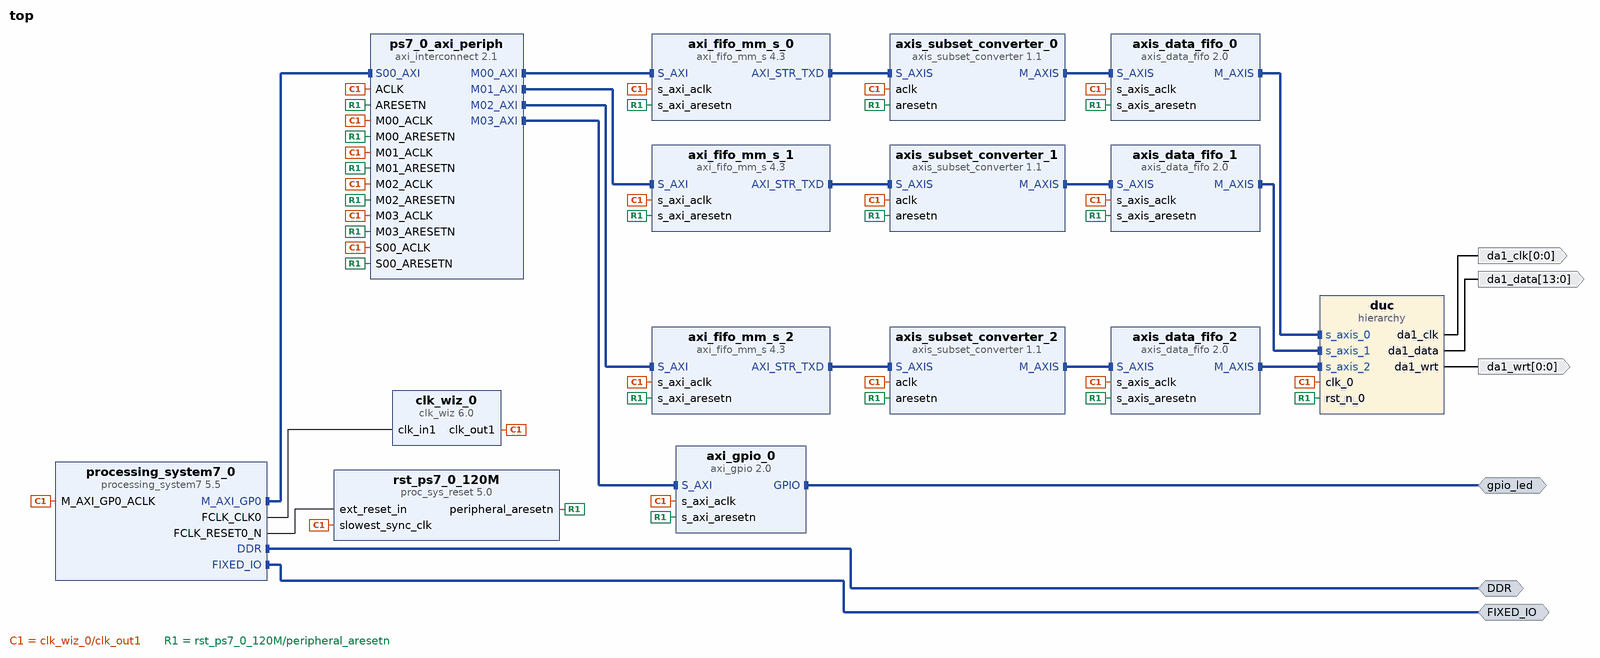
[diagram p0: block diagram of the top level]
# Vivado block design top, xc7z020clg400-2, Vivado 2023.2
create_bd_design top

create_bd_intf_port -mode Master -vlnv xilinx.com:interface:ddrx_rtl:1.0 DDR
create_bd_intf_port -mode Master -vlnv xilinx.com:display_processing_system7:fixedio_rtl:1.0 FIXED_IO
create_bd_intf_port -mode Master -vlnv xilinx.com:interface:gpio_rtl:1.0 gpio_led
create_bd_port -dir O -from 0 -to 0 da1_clk
create_bd_port -dir O -from 0 -to 0 da1_wrt
create_bd_port -dir O -from 13 -to 0 da1_data

create_bd_cell -type ip -vlnv xilinx.com:ip:processing_system7:5.5 processing_system7_0
set_property -dict [list \
  CONFIG.PCW_ENET0_ENET0_IO {MIO 16 .. 27} \
  CONFIG.PCW_ENET0_GRP_MDIO_ENABLE 1 \
  CONFIG.PCW_ENET0_GRP_MDIO_IO {MIO 52 .. 53} \
  CONFIG.PCW_ENET0_PERIPHERAL_ENABLE 1 \
  CONFIG.PCW_ENET0_RESET_ENABLE 0 \
  CONFIG.PCW_ENET_RESET_ENABLE 1 \
  CONFIG.PCW_ENET_RESET_SELECT {Share reset pin} \
  CONFIG.PCW_FPGA0_PERIPHERAL_FREQMHZ 120 \
  CONFIG.PCW_GPIO_EMIO_GPIO_ENABLE 1 \
  CONFIG.PCW_GPIO_EMIO_GPIO_IO 64 \
  CONFIG.PCW_GPIO_MIO_GPIO_ENABLE 1 \
  CONFIG.PCW_GPIO_MIO_GPIO_IO MIO \
  CONFIG.PCW_I2C_RESET_ENABLE 1 \
  CONFIG.PCW_PRESET_BANK1_VOLTAGE {LVCMOS 1.8V} \
  CONFIG.PCW_QSPI_GRP_SINGLE_SS_ENABLE 1 \
  CONFIG.PCW_QSPI_GRP_SINGLE_SS_IO {MIO 1 .. 6} \
  CONFIG.PCW_QSPI_PERIPHERAL_ENABLE 1 \
  CONFIG.PCW_QSPI_QSPI_IO {MIO 1 .. 6} \
  CONFIG.PCW_SD0_GRP_CD_ENABLE 1 \
  CONFIG.PCW_SD0_GRP_CD_IO {MIO 47} \
  CONFIG.PCW_SD0_GRP_WP_ENABLE 0 \
  CONFIG.PCW_SD0_PERIPHERAL_ENABLE 1 \
  CONFIG.PCW_SD0_SD0_IO {MIO 40 .. 45} \
  CONFIG.PCW_SDIO_PERIPHERAL_FREQMHZ 100 \
  CONFIG.PCW_SINGLE_QSPI_DATA_MODE x4 \
  CONFIG.PCW_UART1_PERIPHERAL_ENABLE 1 \
  CONFIG.PCW_UART1_UART1_IO {MIO 48 .. 49} \
  CONFIG.PCW_UART_PERIPHERAL_FREQMHZ 100 \
  CONFIG.PCW_UIPARAM_DDR_PARTNO {MT41J256M16 RE-125} \
  CONFIG.PCW_USB0_PERIPHERAL_ENABLE 1 \
  CONFIG.PCW_USB0_RESET_ENABLE 1 \
  CONFIG.PCW_USB0_RESET_IO {MIO 46} \
  CONFIG.PCW_USB0_USB0_IO {MIO 28 .. 39} \
  CONFIG.PCW_USB_RESET_ENABLE 1 \
  CONFIG.PCW_USB_RESET_SELECT {Share reset pin} \
  CONFIG.PCW_USE_FABRIC_INTERRUPT 1 \
] [get_bd_cells processing_system7_0]
# 208 more settings of processing_system7_0 are not shown: defaults, MIO pin electricals, DDR timing, and values the tool derives
create_bd_cell -type ip -vlnv xilinx.com:ip:proc_sys_reset:5.0 rst_ps7_0_120M
create_bd_cell -type hier duc
create_bd_cell -type ip -vlnv xilinx.com:ip:clk_wiz:6.0 clk_wiz_0
set_property -dict [list \
  CONFIG.CLKIN1_JITTER_PS 80.000 \
  CONFIG.CLKIN1_UI_JITTER 80.000 \
  CONFIG.CLKIN2_JITTER_PS 100.000 \
  CONFIG.CLKIN2_UI_JITTER 100.000 \
  CONFIG.CLKOUT1_JITTER 213.738 \
  CONFIG.CLKOUT1_PHASE_ERROR 240.486 \
  CONFIG.CLKOUT1_REQUESTED_OUT_FREQ 120 \
  CONFIG.JITTER_OPTIONS PS \
  CONFIG.MMCM_CLKFBOUT_MULT_F 39.000 \
  CONFIG.MMCM_CLKIN1_PERIOD 8.000 \
  CONFIG.MMCM_CLKOUT0_DIVIDE_F 8.125 \
  CONFIG.MMCM_DIVCLK_DIVIDE 5 \
  CONFIG.MMCM_REF_JITTER2 0.010 \
  CONFIG.PRIM_IN_FREQ 125.000 \
  CONFIG.PRIM_SOURCE No_buffer \
  CONFIG.USE_LOCKED false \
  CONFIG.USE_RESET false \
] [get_bd_cells clk_wiz_0]
create_bd_cell -type ip -vlnv xilinx.com:ip:axis_data_fifo:2.0 axis_data_fifo_0
set_property -dict [list \
  CONFIG.ACLKEN_CONV_MODE 0 \
  CONFIG.ENABLE_ECC 1 \
  CONFIG.FIFO_DEPTH 8192 \
  CONFIG.FIFO_MEMORY_TYPE block \
  CONFIG.HAS_PROG_FULL 1 \
  CONFIG.HAS_RD_DATA_COUNT 1 \
  CONFIG.HAS_TLAST 0 \
  CONFIG.HAS_WR_DATA_COUNT 1 \
  CONFIG.PROG_FULL_THRESH 8000 \
  CONFIG.TDATA_NUM_BYTES 2 \
] [get_bd_cells axis_data_fifo_0]
create_bd_cell -type ip -vlnv xilinx.com:ip:axi_interconnect:2.1 ps7_0_axi_periph
set_property -dict {CONFIG.NUM_MI 4} [get_bd_cells ps7_0_axi_periph]
create_bd_cell -type ip -vlnv xilinx.com:ip:axi_fifo_mm_s:4.3 axi_fifo_mm_s_0
set_property -dict [list \
  CONFIG.C_TX_CASCADE_HEIGHT 1 \
  CONFIG.C_TX_FIFO_DEPTH 8192 \
  CONFIG.C_TX_FIFO_PE_THRESHOLD 5 \
  CONFIG.C_TX_FIFO_PF_THRESHOLD 8100 \
  CONFIG.C_USE_RX_DATA 0 \
  CONFIG.C_USE_TX_CTRL 0 \
  CONFIG.C_USE_TX_CUT_THROUGH 1 \
] [get_bd_cells axi_fifo_mm_s_0]
create_bd_cell -type ip -vlnv xilinx.com:ip:axis_subset_converter:1.1 axis_subset_converter_0
set_property -dict {CONFIG.M_TDATA_NUM_BYTES 2 CONFIG.S_TDATA_NUM_BYTES 4} [get_bd_cells axis_subset_converter_0]
create_bd_cell -type ip -vlnv xilinx.com:ip:axi_fifo_mm_s:4.3 axi_fifo_mm_s_1
set_property -dict [list \
  CONFIG.C_TX_FIFO_DEPTH 8192 \
  CONFIG.C_TX_FIFO_PE_THRESHOLD 5 \
  CONFIG.C_TX_FIFO_PF_THRESHOLD 8000 \
  CONFIG.C_USE_RX_DATA 0 \
  CONFIG.C_USE_TX_CTRL 0 \
  CONFIG.C_USE_TX_CUT_THROUGH 1 \
] [get_bd_cells axi_fifo_mm_s_1]
create_bd_cell -type ip -vlnv xilinx.com:ip:axi_fifo_mm_s:4.3 axi_fifo_mm_s_2
set_property -dict [list \
  CONFIG.C_TX_FIFO_DEPTH 8192 \
  CONFIG.C_TX_FIFO_PE_THRESHOLD 5 \
  CONFIG.C_TX_FIFO_PF_THRESHOLD 8000 \
  CONFIG.C_USE_RX_DATA 0 \
  CONFIG.C_USE_TX_CTRL 0 \
  CONFIG.C_USE_TX_CUT_THROUGH 1 \
] [get_bd_cells axi_fifo_mm_s_2]
create_bd_cell -type ip -vlnv xilinx.com:ip:axis_subset_converter:1.1 axis_subset_converter_1
set_property -dict {CONFIG.M_TDATA_NUM_BYTES 2 CONFIG.S_TDATA_NUM_BYTES 4} [get_bd_cells axis_subset_converter_1]
create_bd_cell -type ip -vlnv xilinx.com:ip:axis_subset_converter:1.1 axis_subset_converter_2
set_property -dict {CONFIG.M_TDATA_NUM_BYTES 2 CONFIG.S_TDATA_NUM_BYTES 4} [get_bd_cells axis_subset_converter_2]
create_bd_cell -type ip -vlnv xilinx.com:ip:axis_data_fifo:2.0 axis_data_fifo_1
set_property -dict [list \
  CONFIG.ACLKEN_CONV_MODE 0 \
  CONFIG.ENABLE_ECC 1 \
  CONFIG.FIFO_DEPTH 8192 \
  CONFIG.FIFO_MEMORY_TYPE block \
  CONFIG.HAS_PROG_FULL 1 \
  CONFIG.HAS_RD_DATA_COUNT 1 \
  CONFIG.HAS_TLAST 0 \
  CONFIG.HAS_WR_DATA_COUNT 1 \
  CONFIG.PROG_FULL_THRESH 8000 \
  CONFIG.TDATA_NUM_BYTES 2 \
] [get_bd_cells axis_data_fifo_1]
create_bd_cell -type ip -vlnv xilinx.com:ip:axis_data_fifo:2.0 axis_data_fifo_2
set_property -dict [list \
  CONFIG.ACLKEN_CONV_MODE 0 \
  CONFIG.ENABLE_ECC 1 \
  CONFIG.FIFO_DEPTH 8192 \
  CONFIG.FIFO_MEMORY_TYPE block \
  CONFIG.HAS_PROG_FULL 1 \
  CONFIG.HAS_RD_DATA_COUNT 1 \
  CONFIG.HAS_TLAST 0 \
  CONFIG.HAS_WR_DATA_COUNT 1 \
  CONFIG.PROG_FULL_THRESH 8000 \
  CONFIG.TDATA_NUM_BYTES 2 \
] [get_bd_cells axis_data_fifo_2]
create_bd_cell -type ip -vlnv xilinx.com:ip:axi_gpio:2.0 axi_gpio_0
set_property -dict {CONFIG.C_ALL_OUTPUTS 1 CONFIG.C_DOUT_DEFAULT 0x00000002 CONFIG.C_GPIO_WIDTH 4} [get_bd_cells axi_gpio_0]

# ---- hierarchy /duc ----
current_bd_instance /duc
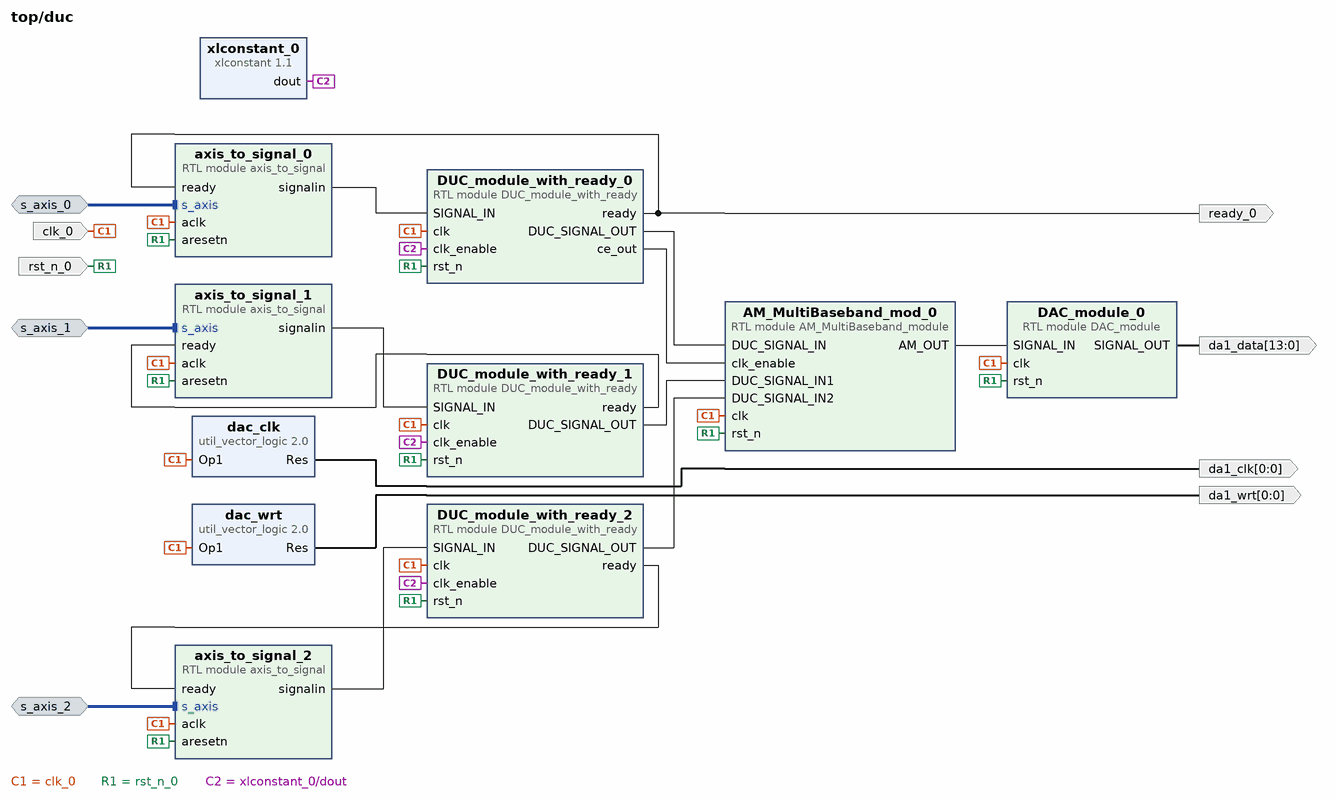
[diagram p1: block diagram inside /duc]
create_bd_intf_pin -mode Slave -vlnv xilinx.com:interface:axis_rtl:1.0 s_axis_0
create_bd_intf_pin -mode Slave -vlnv xilinx.com:interface:axis_rtl:1.0 s_axis_1
create_bd_intf_pin -mode Slave -vlnv xilinx.com:interface:axis_rtl:1.0 s_axis_2
create_bd_pin -dir I -type rst rst_n_0
create_bd_pin -dir I -type clk clk_0
create_bd_pin -dir O -from 0 -to 0 da1_wrt
create_bd_pin -dir O -from 0 -to 0 da1_clk
create_bd_pin -dir O ready_0
create_bd_pin -dir O -from 13 -to 0 da1_data

create_bd_cell -type ip -vlnv xilinx.com:ip:util_vector_logic:2.0 dac_clk
set_property -dict {CONFIG.C_OPERATION not CONFIG.C_SIZE 1} [get_bd_cells dac_clk]
create_bd_cell -type ip -vlnv xilinx.com:ip:util_vector_logic:2.0 dac_wrt
set_property -dict {CONFIG.C_OPERATION not CONFIG.C_SIZE 1} [get_bd_cells dac_wrt]
create_bd_cell -type ip -vlnv xilinx.com:ip:xlconstant:1.1 xlconstant_0
create_bd_cell -type module -reference DAC_module DAC_module_0
create_bd_cell -type module -reference DUC_module_with_ready DUC_module_with_ready_0
create_bd_cell -type module -reference axis_to_signal axis_to_signal_0
create_bd_cell -type module -reference AM_MultiBaseband_module AM_MultiBaseband_mod_0
create_bd_cell -type module -reference axis_to_signal axis_to_signal_1
create_bd_cell -type module -reference axis_to_signal axis_to_signal_2
create_bd_cell -type module -reference DUC_module_with_ready DUC_module_with_ready_1
create_bd_cell -type module -reference DUC_module_with_ready DUC_module_with_ready_2

# ---- connections ----

current_bd_instance /duc
connect_bd_intf_net [get_bd_intf_pins axis_to_signal_0/s_axis] [get_bd_intf_pins s_axis_0]
connect_bd_intf_net [get_bd_intf_pins axis_to_signal_1/s_axis] [get_bd_intf_pins s_axis_1]
connect_bd_intf_net [get_bd_intf_pins axis_to_signal_2/s_axis] [get_bd_intf_pins s_axis_2]
connect_bd_net [get_bd_pins AM_MultiBaseband_mod_0/AM_OUT] [get_bd_pins DAC_module_0/SIGNAL_IN]
connect_bd_net [get_bd_pins DAC_module_0/SIGNAL_OUT] [get_bd_pins da1_data]
connect_bd_net [get_bd_pins DUC_module_with_ready_0/DUC_SIGNAL_OUT] [get_bd_pins AM_MultiBaseband_mod_0/DUC_SIGNAL_IN]
connect_bd_net [get_bd_pins DUC_module_with_ready_0/ce_out] [get_bd_pins AM_MultiBaseband_mod_0/clk_enable]
connect_bd_net [get_bd_pins DUC_module_with_ready_0/ready] [get_bd_pins ready_0] [get_bd_pins axis_to_signal_0/ready]
connect_bd_net [get_bd_pins DUC_module_with_ready_1/DUC_SIGNAL_OUT] [get_bd_pins AM_MultiBaseband_mod_0/DUC_SIGNAL_IN1]
connect_bd_net [get_bd_pins DUC_module_with_ready_1/ready] [get_bd_pins axis_to_signal_1/ready]
connect_bd_net [get_bd_pins DUC_module_with_ready_2/DUC_SIGNAL_OUT] [get_bd_pins AM_MultiBaseband_mod_0/DUC_SIGNAL_IN2]
connect_bd_net [get_bd_pins DUC_module_with_ready_2/ready] [get_bd_pins axis_to_signal_2/ready]
connect_bd_net [get_bd_pins axis_to_signal_0/signalin] [get_bd_pins DUC_module_with_ready_0/SIGNAL_IN]
connect_bd_net [get_bd_pins axis_to_signal_1/signalin] [get_bd_pins DUC_module_with_ready_1/SIGNAL_IN]
connect_bd_net [get_bd_pins axis_to_signal_2/signalin] [get_bd_pins DUC_module_with_ready_2/SIGNAL_IN]
connect_bd_net -net clk_0_1 [get_bd_pins clk_0] \
  [get_bd_pins DAC_module_0/clk] [get_bd_pins dac_clk/Op1] [get_bd_pins dac_wrt/Op1] [get_bd_pins axis_to_signal_0/aclk] \
  [get_bd_pins DUC_module_with_ready_0/clk] [get_bd_pins AM_MultiBaseband_mod_0/clk] \
  [get_bd_pins DUC_module_with_ready_1/clk] [get_bd_pins DUC_module_with_ready_2/clk] [get_bd_pins axis_to_signal_1/aclk] \
  [get_bd_pins axis_to_signal_2/aclk]
connect_bd_net -net rst_n_0_1 [get_bd_pins rst_n_0] \
  [get_bd_pins DAC_module_0/rst_n] [get_bd_pins axis_to_signal_0/aresetn] [get_bd_pins DUC_module_with_ready_0/rst_n] \
  [get_bd_pins AM_MultiBaseband_mod_0/rst_n] [get_bd_pins DUC_module_with_ready_1/rst_n] \
  [get_bd_pins DUC_module_with_ready_2/rst_n] [get_bd_pins axis_to_signal_2/aresetn] [get_bd_pins axis_to_signal_1/aresetn]
connect_bd_net -net util_vector_logic_0_Res [get_bd_pins dac_clk/Res] [get_bd_pins da1_clk]
connect_bd_net -net util_vector_logic_1_Res [get_bd_pins dac_wrt/Res] [get_bd_pins da1_wrt]
connect_bd_net [get_bd_pins xlconstant_0/dout] \
  [get_bd_pins DUC_module_with_ready_0/clk_enable] [get_bd_pins DUC_module_with_ready_1/clk_enable] \
  [get_bd_pins DUC_module_with_ready_2/clk_enable]

current_bd_instance /
connect_bd_intf_net -intf_net axi_dma_0_M_AXIS_MM2S [get_bd_intf_pins axi_fifo_mm_s_0/AXI_STR_TXD] [get_bd_intf_pins axis_subset_converter_0/S_AXIS]
connect_bd_intf_net [get_bd_intf_pins axi_fifo_mm_s_1/AXI_STR_TXD] [get_bd_intf_pins axis_subset_converter_1/S_AXIS]
connect_bd_intf_net [get_bd_intf_pins axi_fifo_mm_s_2/AXI_STR_TXD] [get_bd_intf_pins axis_subset_converter_2/S_AXIS]
connect_bd_intf_net [get_bd_intf_ports gpio_led] [get_bd_intf_pins axi_gpio_0/GPIO]
connect_bd_intf_net [get_bd_intf_pins axis_subset_converter_0/M_AXIS] [get_bd_intf_pins axis_data_fifo_0/S_AXIS]
connect_bd_intf_net [get_bd_intf_pins axis_subset_converter_1/M_AXIS] [get_bd_intf_pins axis_data_fifo_1/S_AXIS]
connect_bd_intf_net [get_bd_intf_pins axis_subset_converter_2/M_AXIS] [get_bd_intf_pins axis_data_fifo_2/S_AXIS]
connect_bd_intf_net [get_bd_intf_ports DDR] [get_bd_intf_pins processing_system7_0/DDR]
connect_bd_intf_net [get_bd_intf_ports FIXED_IO] [get_bd_intf_pins processing_system7_0/FIXED_IO]
connect_bd_intf_net [get_bd_intf_pins processing_system7_0/M_AXI_GP0] [get_bd_intf_pins ps7_0_axi_periph/S00_AXI]
connect_bd_intf_net [get_bd_intf_pins ps7_0_axi_periph/M00_AXI] [get_bd_intf_pins axi_fifo_mm_s_0/S_AXI]
connect_bd_intf_net [get_bd_intf_pins ps7_0_axi_periph/M01_AXI] [get_bd_intf_pins axi_fifo_mm_s_1/S_AXI]
connect_bd_intf_net [get_bd_intf_pins ps7_0_axi_periph/M02_AXI] [get_bd_intf_pins axi_fifo_mm_s_2/S_AXI]
connect_bd_intf_net [get_bd_intf_pins ps7_0_axi_periph/M03_AXI] [get_bd_intf_pins axi_gpio_0/S_AXI]
connect_bd_intf_net -intf_net s_axis_0_1 [get_bd_intf_pins duc/s_axis_0] [get_bd_intf_pins axis_data_fifo_0/M_AXIS]
connect_bd_intf_net -intf_net s_axis_1_1 [get_bd_intf_pins duc/s_axis_1] [get_bd_intf_pins axis_data_fifo_1/M_AXIS]
connect_bd_intf_net -intf_net s_axis_2_1 [get_bd_intf_pins duc/s_axis_2] [get_bd_intf_pins axis_data_fifo_2/M_AXIS]
connect_bd_net [get_bd_pins duc/da1_clk] [get_bd_ports da1_clk]
connect_bd_net [get_bd_pins duc/da1_data] [get_bd_ports da1_data]
connect_bd_net [get_bd_pins duc/da1_wrt] [get_bd_ports da1_wrt]
connect_bd_net -net processing_system7_0_FCLK_CLK0 [get_bd_pins clk_wiz_0/clk_out1] \
  [get_bd_pins processing_system7_0/M_AXI_GP0_ACLK] [get_bd_pins duc/clk_0] [get_bd_pins rst_ps7_0_120M/slowest_sync_clk] \
  [get_bd_pins axis_data_fifo_0/s_axis_aclk] [get_bd_pins ps7_0_axi_periph/S00_ACLK] [get_bd_pins ps7_0_axi_periph/M00_ACLK] \
  [get_bd_pins ps7_0_axi_periph/ACLK] [get_bd_pins axi_fifo_mm_s_0/s_axi_aclk] [get_bd_pins axis_subset_converter_0/aclk] \
  [get_bd_pins axi_fifo_mm_s_1/s_axi_aclk] [get_bd_pins ps7_0_axi_periph/M01_ACLK] [get_bd_pins axi_fifo_mm_s_2/s_axi_aclk] \
  [get_bd_pins ps7_0_axi_periph/M02_ACLK] [get_bd_pins axis_subset_converter_2/aclk] \
  [get_bd_pins axis_subset_converter_1/aclk] [get_bd_pins axis_data_fifo_2/s_axis_aclk] \
  [get_bd_pins axis_data_fifo_1/s_axis_aclk] [get_bd_pins axi_gpio_0/s_axi_aclk] [get_bd_pins ps7_0_axi_periph/M03_ACLK]
connect_bd_net [get_bd_pins processing_system7_0/FCLK_CLK0] [get_bd_pins clk_wiz_0/clk_in1]
connect_bd_net [get_bd_pins processing_system7_0/FCLK_RESET0_N] [get_bd_pins rst_ps7_0_120M/ext_reset_in]
connect_bd_net [get_bd_pins rst_ps7_0_120M/peripheral_aresetn] \
  [get_bd_pins duc/rst_n_0] [get_bd_pins axis_data_fifo_0/s_axis_aresetn] [get_bd_pins ps7_0_axi_periph/S00_ARESETN] \
  [get_bd_pins ps7_0_axi_periph/M00_ARESETN] [get_bd_pins ps7_0_axi_periph/ARESETN] \
  [get_bd_pins axi_fifo_mm_s_0/s_axi_aresetn] [get_bd_pins axis_subset_converter_0/aresetn] \
  [get_bd_pins axi_fifo_mm_s_1/s_axi_aresetn] [get_bd_pins ps7_0_axi_periph/M01_ARESETN] \
  [get_bd_pins axi_fifo_mm_s_2/s_axi_aresetn] [get_bd_pins ps7_0_axi_periph/M02_ARESETN] \
  [get_bd_pins axis_subset_converter_1/aresetn] [get_bd_pins axis_subset_converter_2/aresetn] \
  [get_bd_pins axis_data_fifo_1/s_axis_aresetn] [get_bd_pins axis_data_fifo_2/s_axis_aresetn] \
  [get_bd_pins axi_gpio_0/s_axi_aresetn] [get_bd_pins ps7_0_axi_periph/M03_ARESETN]

# ---- address map ----
assign_bd_address -offset 0x41200000 -range 64K -target_address_space [get_bd_addr_spaces processing_system7_0/Data] [get_bd_addr_segs axi_gpio_0/S_AXI/Reg]
assign_bd_address -offset 0x43C00000 -range 64K -target_address_space [get_bd_addr_spaces processing_system7_0/Data] [get_bd_addr_segs axi_fifo_mm_s_0/S_AXI/Mem0]
assign_bd_address -offset 0x43C10000 -range 64K -target_address_space [get_bd_addr_spaces processing_system7_0/Data] [get_bd_addr_segs axi_fifo_mm_s_1/S_AXI/Mem0]
assign_bd_address -offset 0x43C20000 -range 64K -target_address_space [get_bd_addr_spaces processing_system7_0/Data] [get_bd_addr_segs axi_fifo_mm_s_2/S_AXI/Mem0]

validate_bd_design
save_bd_design
